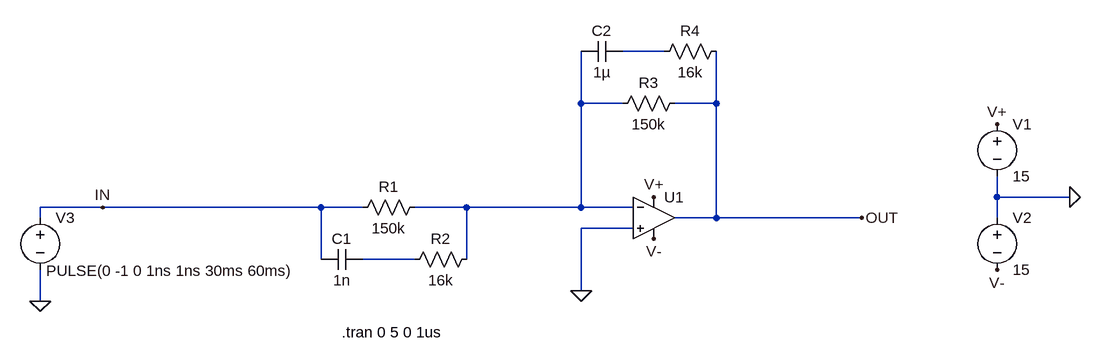
[diagram p0: schematic Simulation.asc]
Simulation.asc, the LTspice schematic file:
Version 4.1
SHEET 1 884 680
WIRE 240 -96 176 -96
WIRE 112 -16 112 -96
WIRE 176 -16 112 -16
WIRE 320 -16 320 -96
WIRE 320 -16 256 -16
WIRE 752 128 752 96
WIRE 864 128 752 128
WIRE -624 144 -720 144
WIRE -288 144 -624 144
WIRE -224 144 -288 144
WIRE -64 144 -144 144
WIRE 112 144 112 -16
WIRE 112 144 -64 144
WIRE 192 144 112 144
WIRE -720 160 -720 144
WIRE 320 160 320 -16
WIRE 320 160 256 160
WIRE 544 160 320 160
WIRE 752 160 752 128
WIRE 192 176 112 176
WIRE -288 224 -288 144
WIRE -144 224 -224 224
WIRE -64 224 -64 144
WIRE 112 272 112 176
WIRE -720 288 -720 240
FLAG 864 128 0
FLAG 752 240 V-
FLAG 752 16 V+
FLAG 224 192 V-
FLAG 224 128 V+
FLAG 112 272 0
FLAG -720 288 0
FLAG 544 160 OUT
FLAG -624 144 IN
SYMBOL voltage 752 0 R0
SYMATTR InstName V1
SYMATTR Value 15
SYMBOL voltage 752 144 R0
SYMATTR InstName V2
SYMATTR Value 15
SYMBOL res -128 128 R90
WINDOW 0 0 56 VBottom 2
WINDOW 3 32 56 VTop 2
SYMATTR InstName R1
SYMATTR Value 150k
SYMBOL res -48 208 R90
WINDOW 0 0 56 VBottom 2
WINDOW 3 32 56 VTop 2
SYMATTR InstName R2
SYMATTR Value 16k
SYMBOL OpAmps\\UniversalOpAmp 224 160 R0
SYMATTR InstName U1
SYMATTR Value2 Avol=1Meg GBW=1G Vos=0
SYMBOL cap -224 208 R90
WINDOW 0 0 32 VBottom 2
WINDOW 3 32 32 VTop 2
SYMATTR InstName C1
SYMATTR Value 1n
SYMBOL res 160 0 R270
WINDOW 0 32 56 VTop 2
WINDOW 3 0 56 VBottom 2
SYMATTR InstName R3
SYMATTR Value 150k
SYMBOL res 224 -80 R270
WINDOW 0 32 56 VTop 2
WINDOW 3 0 56 VBottom 2
SYMATTR InstName R4
SYMATTR Value 16k
SYMBOL cap 112 -80 R270
WINDOW 0 32 32 VTop 2
WINDOW 3 0 32 VBottom 2
SYMATTR InstName C2
SYMATTR Value 1µ
SYMBOL voltage -720 144 R0
WINDOW 123 9 97 Left 2
WINDOW 39 0 0 Left 0
SYMATTR Value2 PULSE(0 -1 0 1ns 1ns 30ms 60ms)
SYMATTR InstName V3
SYMATTR Value ""
TEXT -256 336 Left 2 !.tran 0 5 0 1us

The netlist it stands for:
* Simulation.asc
V1 V+ 0 15
V2 0 V- 15
R1 N002 IN 150k
R2 N002 N003 16k
X§U1 0 N002 V+ V- OUT level1 Avol=1Meg GBW=1G Vos=0 En=0 Enk=0 In=0 Ink=0 Rin=500Meg  ; pins In+ In- V+ V- OUT
C1 N003 IN 1n
R3 N002 OUT 150k
R4 N001 OUT 16k
C2 N002 N001 1µ
V3 IN 0 PULSE(0 -1 0 1ns 1ns 30ms 60ms)
.tran 0 5 0 1us
.lib UniversalOpAmp1.lib
.backanno
.end